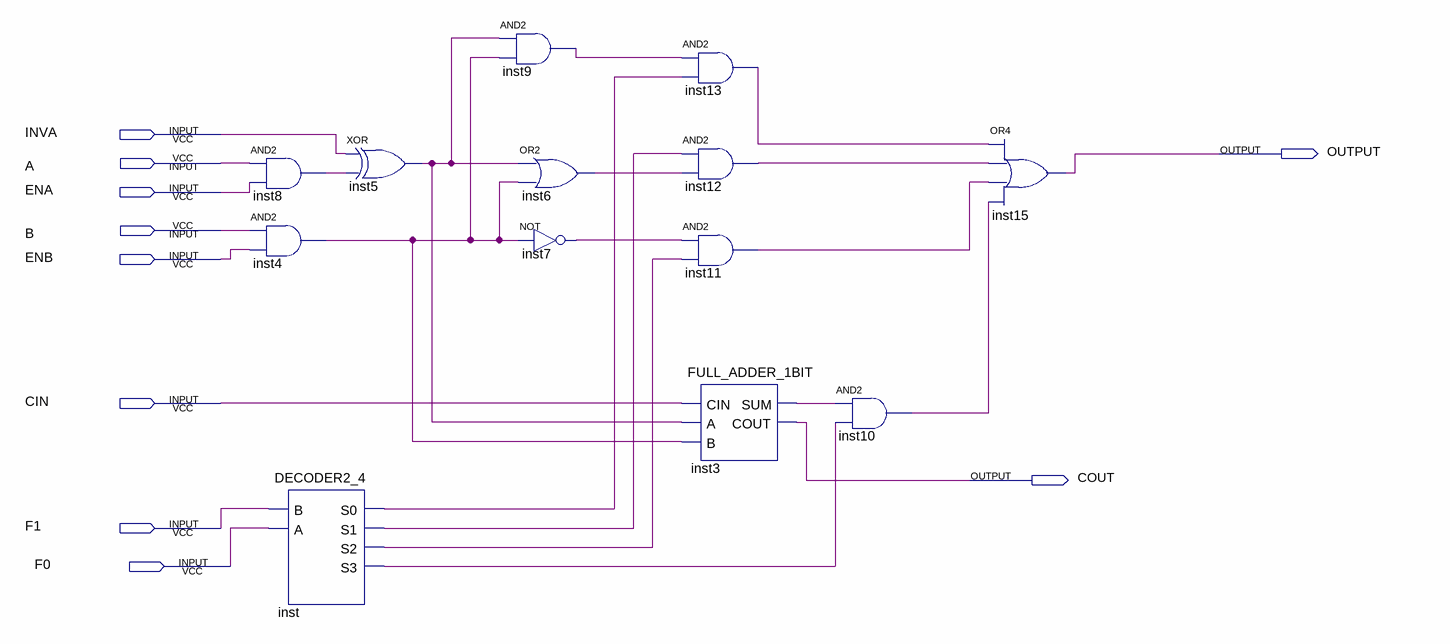
[diagram p0: schematic sheet]
// Quartus schematic ULA_1BIT.bdf as structural Verilog: 13 symbols, 10 pins
module ULA_1BIT (
  input  INVA,
  input  A,
  input  ENA,
  input  B,
  input  ENB,
  input  CIN,
  input  F1,
  input  F0,
  output OUTPUT,
  output COUT
);

  wire inst3_sum, inst4_out, inst5_out, inst6_out, inst7_out, inst8_out, inst9_out, inst10_out, inst11_out,
       inst12_out, inst13_out, inst_s0, inst_s1, inst_s2, inst_s3;

  and inst8 (inst8_out, A, ENA);
  and inst4 (inst4_out, B, ENB);
  DECODER2_4 inst (.B(F1), .A(F0), .S0(inst_s0), .S1(inst_s1), .S2(inst_s2), .S3(inst_s3));
  xor inst5 (inst5_out, INVA, inst8_out);
  and inst9 (inst9_out, inst5_out, inst4_out);
  or inst6 (inst6_out, inst5_out, inst4_out);
  not inst7 (inst7_out, inst4_out);
  and inst13 (inst13_out, inst9_out, inst_s0);
  and inst12 (inst12_out, inst_s1, inst6_out);
  and inst11 (inst11_out, inst7_out, inst_s2);
  FULL_ADDER_1BIT inst3 (.CIN(CIN), .A(inst5_out), .B(inst4_out), .SUM(inst3_sum), .COUT(COUT));
  and inst10 (inst10_out, inst3_sum, inst_s3);
  or inst15 (OUTPUT, inst13_out, inst12_out, inst11_out, inst10_out);
endmodule
